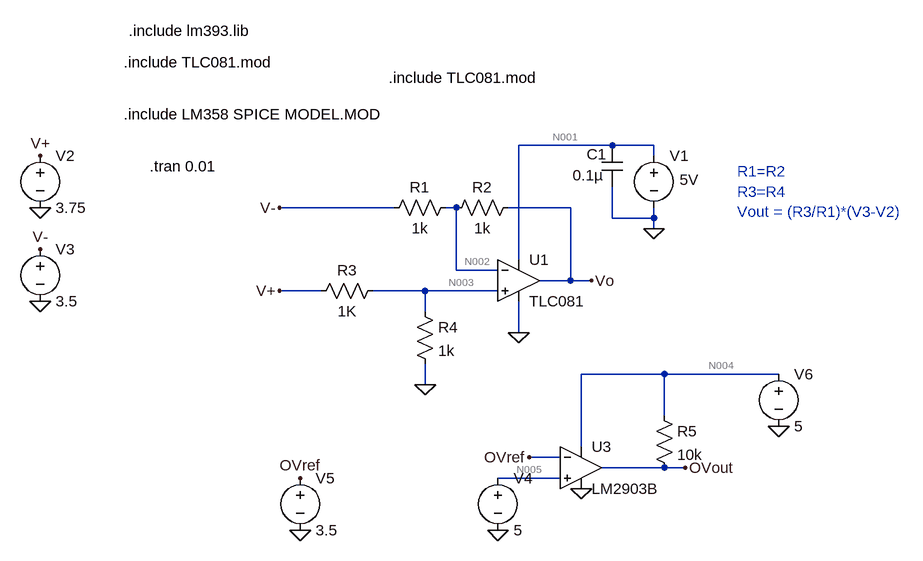
[diagram p0: schematic Draft1.asc]
Draft1.asc, the LTspice schematic file:
Version 4
SHEET 1 1088 784
WIRE 624 176 480 176
WIRE 688 176 624 176
WIRE 688 192 688 176
WIRE 288 272 112 272
WIRE 384 272 368 272
WIRE 560 272 464 272
WIRE 624 288 624 240
WIRE 688 288 688 272
WIRE 688 288 624 288
WIRE 688 304 688 288
WIRE 480 352 480 176
WIRE 384 368 384 272
WIRE 448 368 384 368
WIRE 560 384 560 272
WIRE 560 384 512 384
WIRE 592 384 560 384
WIRE 176 400 112 400
WIRE 336 400 256 400
WIRE 448 400 336 400
WIRE 336 432 336 400
WIRE 480 464 480 416
WIRE 704 528 576 528
WIRE 880 528 704 528
WIRE 336 544 336 512
WIRE 704 592 704 528
WIRE 576 640 576 528
WIRE 544 656 496 656
WIRE 704 672 608 672
WIRE 736 672 704 672
WIRE 544 688 448 688
FLAG 688 304 0
FLAG 480 464 0
FLAG 336 544 0
FLAG 112 400 V+
FLAG 112 272 V-
FLAG -256 416 0
FLAG -256 272 0
FLAG -256 192 V+
FLAG -256 336 V-
FLAG 592 384 Vo
FLAG 736 672 OVout
FLAG 496 656 OVref
FLAG 576 704 0
FLAG 448 768 0
FLAG 144 768 0
FLAG 144 688 OVref
FLAG 880 608 0
SYMBOL voltage 688 176 R0
WINDOW 3 40 53 Left 2
WINDOW 123 0 0 Left 2
WINDOW 39 0 0 Left 2
SYMATTR Value 5V
SYMATTR InstName V1
SYMBOL res 384 256 R90
WINDOW 0 0 56 VBottom 2
WINDOW 3 32 56 VTop 2
SYMATTR InstName R1
SYMATTR Value 1k
SYMBOL cap 608 176 R0
WINDOW 0 -23 14 Left 2
WINDOW 3 -45 46 Left 2
SYMATTR InstName C1
SYMATTR Value 0.1µ
SYMBOL res 480 256 R90
WINDOW 0 0 56 VBottom 2
WINDOW 3 32 56 VTop 2
SYMATTR InstName R2
SYMATTR Value 1k
SYMBOL res 272 384 R90
WINDOW 0 0 56 VBottom 2
WINDOW 3 32 56 VTop 2
SYMATTR InstName R3
SYMATTR Value 1K
SYMBOL res 320 416 R0
SYMATTR InstName R4
SYMATTR Value 1k
SYMBOL voltage -256 176 R0
SYMATTR InstName V2
SYMATTR Value 3.75
SYMBOL voltage -256 320 R0
SYMATTR InstName V3
SYMATTR Value 3.5
SYMBOL OpAmps/opamp2 576 608 R0
SYMATTR InstName U3
SYMATTR Value LM2903B
SYMBOL Voltage 448 672 R0
SYMATTR InstName V4
SYMATTR Value 5
SYMBOL Res 688 576 R0
SYMATTR InstName R5
SYMATTR Value 10k
SYMBOL Voltage 144 672 R0
SYMATTR InstName V5
SYMATTR Value 3.5
SYMBOL Voltage 880 512 R0
SYMATTR InstName V6
SYMATTR Value 5
SYMBOL OpAmps/opamp2 480 320 R0
SYMATTR InstName U1
SYMATTR Value TLC081
TEXT 816 216 Left 2 ;R1=R2\nR3=R4\nVout = (R3/R1)*(V3-V2)
TEXT -88 208 Left 2 !.tran 0.01
TEXT -128 128 Left 2 !.include LM358 SPICE MODEL.MOD
TEXT -128 48 Left 2 !.include TLC081.mod
TEXT -120 0 Left 2 !.include lm393.lib
TEXT 280 72 Left 2 !.include TLC081.mod

The netlist it stands for:
* Draft1.asc
V1 N001 0 5V
R1 N002 V- 1k
C1 N001 0 0.1µ
R2 Vo N002 1k
R3 N003 V+ 1K
R4 N003 0 1k
V2 V+ 0 3.75
V3 V- 0 3.5
XU3 N005 OVref N004 0 OVout LM2903B  ; pins In+ In- V+ V- OUT
V4 N005 0 5
R5 N004 OVout 10k
V5 OVref 0 3.5
V6 N004 0 5
XU1 N003 N002 N001 0 Vo TLC081  ; pins In+ In- V+ V- OUT
* R1=R2
* R3=R4
* Vout = (R3/R1)*(V3-V2)
.tran 0.01
.include LM358 SPICE MODEL.MOD
.include TLC081.mod
.include lm393.lib
.include TLC081.mod
.backanno
.end

* Results of the author's LTspice run, read from the files saved beside the schematic
* Operating Point, zero values left out:
*   V(n001) = 5 V
*   V(n002) = 1.876 V
*   V(v-) = 3.5 V
*   V(vo) = 252.4 mV
*   V(n003) = 1.875 V
*   V(v+) = 3.75 V
*   V(n004) = 5 V
*   V(ovout) = 2.5 V
*   V(n005) = 5 V
*   V(ovref) = 3.5 V
*   I(R1) = -1.624 mA
*   I(R2) = -1.624 mA
*   I(R3) = -1.875 mA
*   I(R4) = 1.875 mA
*   I(R5) = 250 µA
*   I(V1) = -955.7 µA
*   I(V2) = -1.875 mA
*   I(V3) = -1.624 mA
*   I(V4) = 3.5 nA
*   I(V5) = 3.5 nA
*   I(V6) = -800 µA
*   Ix(u3:IN+) = -3.5 nA
*   Ix(u3:IN-) = -3.5 nA
*   Ix(u3:VCC) = 550 µA
*   Ix(u3:GND) = -550 µA
*   Ix(u3:OUT) = 250 µA
*   Ix(u1:1) = 2.504 pA
*   Ix(u1:2) = 2.508 pA
*   Ix(u1:3) = 955.7 µA
*   Ix(u1:4) = -943.9 µA
*   Ix(u1:5) = 1.624 mA